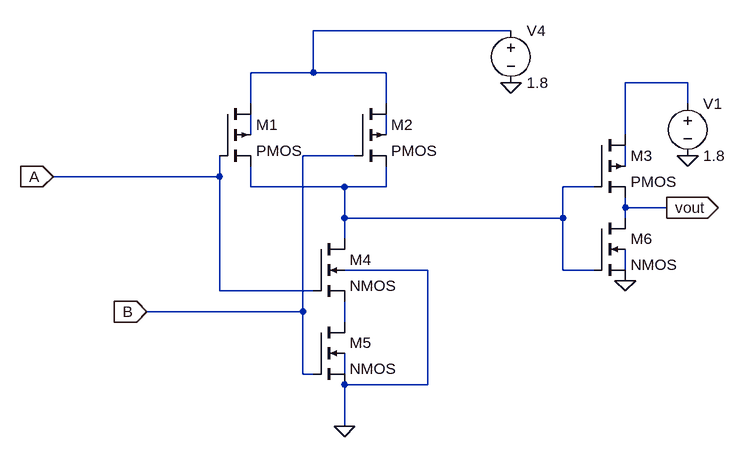
[diagram p0: schematic AND_Static.asc]
AND_Static.asc, the LTspice schematic file:
Version 4
SHEET 1 2896 680
WIRE 464 -176 160 -176
WIRE 160 -112 160 -176
WIRE 160 -112 64 -112
WIRE 272 -112 160 -112
WIRE 736 -96 640 -96
WIRE 64 -64 64 -112
WIRE 272 -64 272 -112
WIRE 736 -64 736 -96
WIRE 64 -16 64 -48
WIRE 272 -16 272 -48
WIRE 640 -16 640 -96
WIRE 224 16 144 16
WIRE 640 32 640 0
WIRE 16 48 16 16
WIRE 16 48 -240 48
WIRE 64 64 64 32
WIRE 208 64 64 64
WIRE 272 64 272 32
WIRE 272 64 208 64
WIRE 592 64 544 64
WIRE 640 96 640 80
WIRE 704 96 640 96
WIRE 208 112 208 64
WIRE 544 112 544 64
WIRE 544 112 208 112
WIRE 640 112 640 96
WIRE 208 144 208 112
WIRE 336 192 208 192
WIRE 544 192 544 112
WIRE 592 192 544 192
WIRE 640 192 640 160
WIRE 16 224 16 48
WIRE 160 224 16 224
WIRE 144 256 144 16
WIRE 144 256 -96 256
WIRE 208 272 208 240
WIRE 144 352 144 256
WIRE 160 352 144 352
WIRE 208 352 208 320
WIRE 336 368 336 192
WIRE 336 368 208 368
WIRE 208 432 208 368
FLAG 640 208 0
FLAG 704 96 vout
IOPIN 704 96 Out
FLAG 736 16 0
FLAG 464 -96 0
FLAG -240 48 A
IOPIN -240 48 In
FLAG -96 256 B
IOPIN -96 256 In
FLAG 208 432 0
SYMBOL voltage 736 -80 R0
WINDOW 123 0 0 Left 0
WINDOW 39 0 0 Left 0
SYMATTR InstName V1
SYMATTR Value 1.8
SYMBOL voltage 464 -192 R0
WINDOW 123 0 0 Left 0
WINDOW 39 0 0 Left 0
SYMATTR InstName V4
SYMATTR Value 1.8
SYMBOL pmos4 16 -64 R0
SYMATTR InstName M1
SYMBOL pmos4 224 -64 R0
SYMATTR InstName M2
SYMBOL pmos4 592 -16 R0
SYMATTR InstName M3
SYMBOL nmos4 160 144 R0
SYMATTR InstName M4
SYMBOL nmos4 160 272 R0
SYMATTR InstName M5
SYMBOL nmos4 592 112 R0
SYMATTR InstName M6

The netlist it stands for:
* AND_Static.asc
V1 N002 0 1.8
V4 N001 0 1.8
M1 N001 A N006 N003 PMOS
M2 N001 B N006 N004 PMOS
M3 N002 N006 vout N005 PMOS
M4 N006 A N008 0 NMOS
M5 N008 B 0 N009 NMOS
M6 vout N006 0 N007 NMOS
.model NMOS NMOS
.model PMOS PMOS
.lib standard.mos
.backanno
.end